# EAGLE design 30ApowerDist (EAGLE 9.1.0)
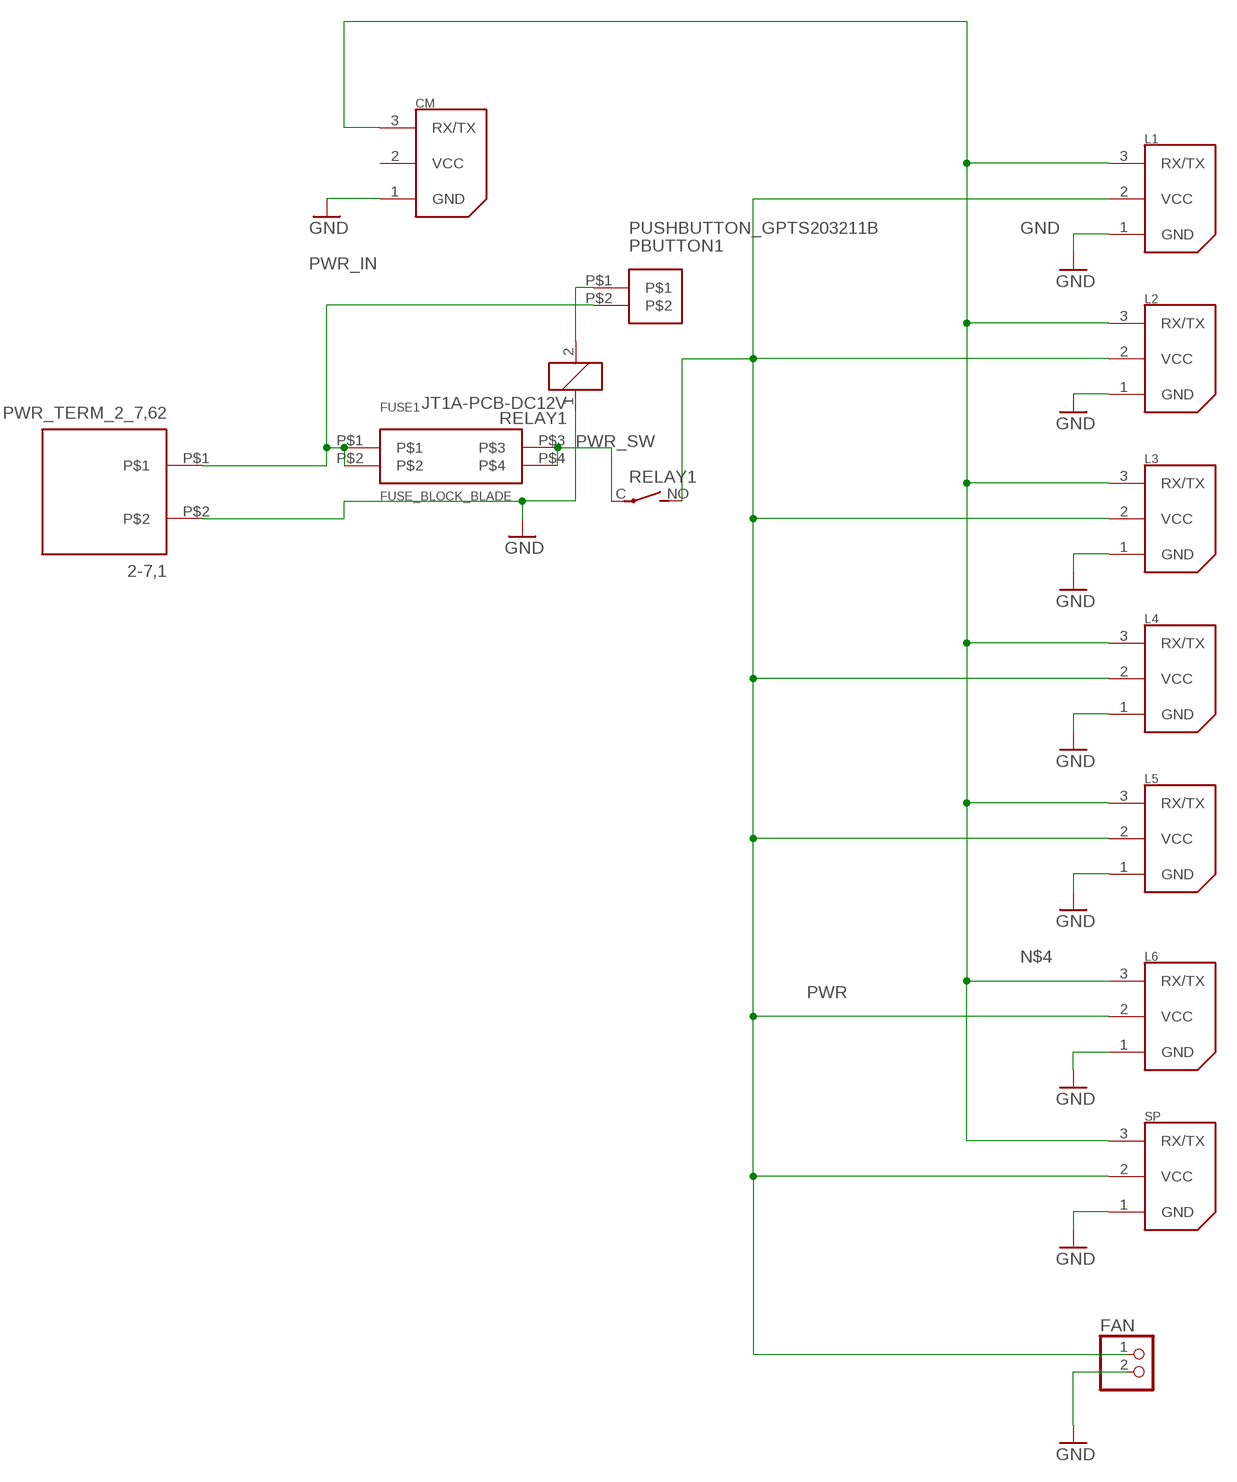
[diagram p0: schematic, sheet 1]

## Parts
2-7,1  PWR_TERM_2_7,62  [PWR_TERM_2_7,62]
CM  22-03-5035  [5267-3]
FAN  PINHD-1X2  [1X02]
FUSE1  FUSE_BLOCK_BLADE  [FUSE_BLOCK_BLADE]
L1  22-03-5035  [5267-3]
L2  22-03-5035  [5267-3]
L3  22-03-5035  [5267-3]
L4  22-03-5035  [5267-3]
L5  22-03-5035  [5267-3]
L6  22-03-5035  [5267-3]
PBUTTON1  PUSHBUTTON_GPTS203211B  [PUSHBUTTON_GPTS203211B]
RELAY1  JT1A-PCB-DC12V  [JT1A-PCB]
SP  22-03-5035  [5267-3]

## Nets
GND: 2-7,1.P$2 CM.1(GND) FAN.2 L1.1(GND) L2.1(GND) L3.1(GND) L4.1(GND) L5.1(GND) L6.1(GND) RELAY1.1 SP.1(GND)
N$1: PBUTTON1.P$1 RELAY1.2
N$4: CM.3(RX/TX) L1.3(RX/TX) L2.3(RX/TX) L3.3(RX/TX) L4.3(RX/TX) L5.3(RX/TX) L6.3(RX/TX) SP.3(RX/TX)
PWR: FAN.1 L1.2(VCC) L2.2(VCC) L3.2(VCC) L4.2(VCC) L5.2(VCC) L6.2(VCC) RELAY1.NO(S) SP.2(VCC)
PWR_IN: 2-7,1.P$1 FUSE1.P$1 FUSE1.P$2 PBUTTON1.P$2
PWR_SW: FUSE1.P$3 FUSE1.P$4 RELAY1.C(P)
Unconnected: CM.2(VCC)

## Library data of the parts
2-7,1 = 30ApwrSupply:PWR_TERM_2_7,62
CM L1-L6 SP = molex:22-03-5035: Molex SPOX Vert, Tin (Dynamixel AX/MX Bus) tested: YES (arbotix)
FAN = pinhead:PINHD-1X2: PIN HEADER
FUSE1 = 30ApwrSupply:FUSE_BLOCK_BLADE
PBUTTON1 = 30ApwrSupply:PUSHBUTTON_GPTS203211B
RELAY1 = relay:JT1A?-*: COMPACT ECONOMICAL 30 AMP. RELAY NAiS Source: http://www.mew-europe.com/.. en_ds_61212_0000.pdf; OC_FARNELL: unknown; OC_NEWARK: unknown

## Board
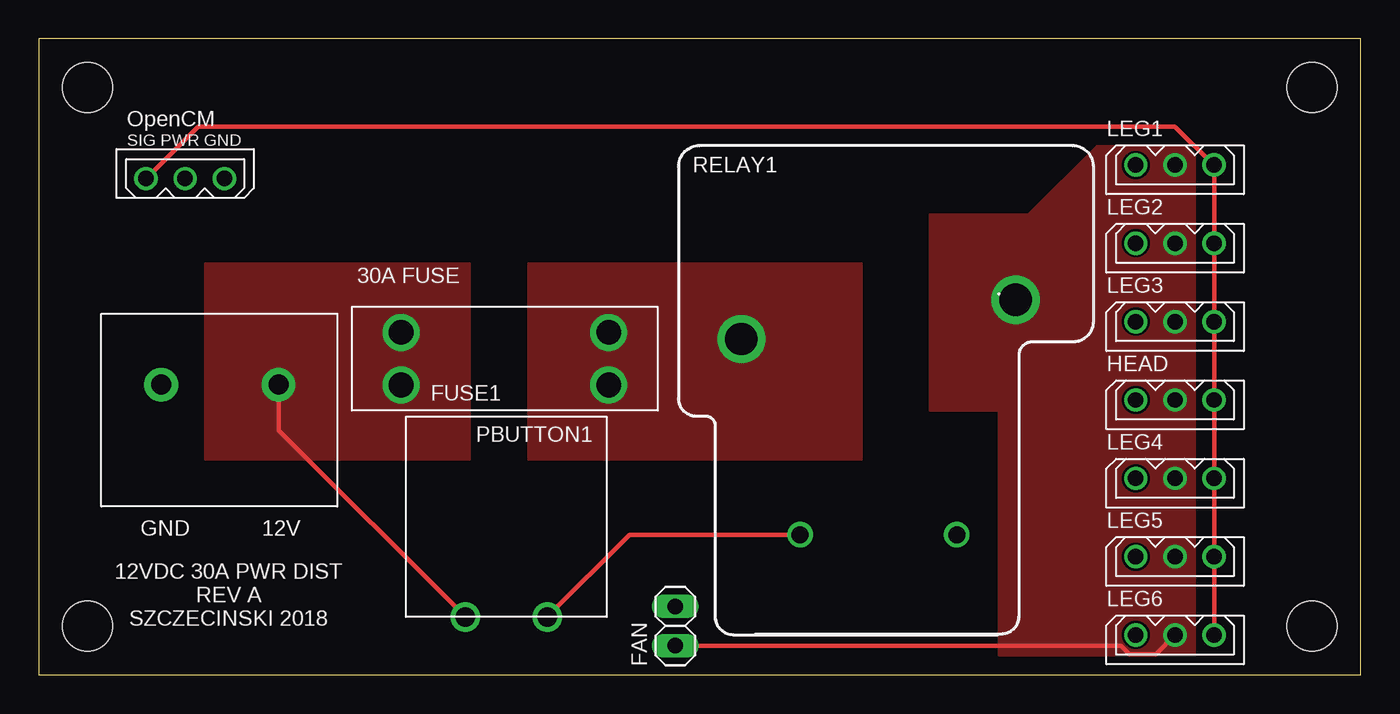
[diagram p1: board, top side]
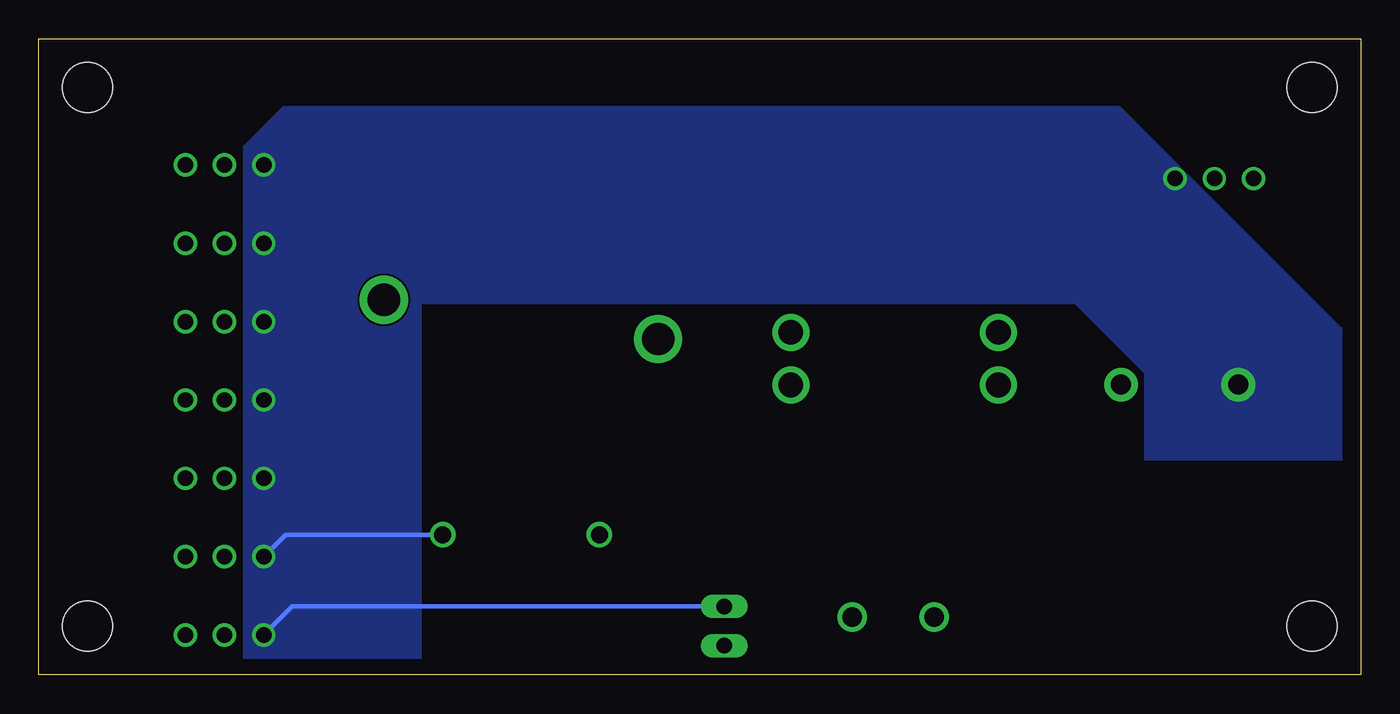
[diagram p2: board, bottom side, seen from below]

Size 85.71 x 41.27 mm. Coordinates in mm from the lower left corner, seen from the top.
Outline: 0,0 85.71,0 85.71,41.27 0,41.27 0,0
Copper layers (1*16): Top 0.035mm / dielectric 1.5mm / Bottom 0.035mm
Design rules "default *": minimum track width 6mil, minimum drill 0.35mm, track to track 6mil, track to pad 6mil, pad to pad 6mil, via to via 6mil, smd to smd 6mil, copper to edge 40mil, drill to drill 6mil, minimum pad ring 10mil, minimum via ring 8mil, stop-mask expansion 4mil, vias tented up to drill 0mil, thermal gap 0mil
Holes 3.25 mm at 3.17,3.17 3.17,38.1 82.55,3.17 82.55,38.1

### Footprints (pad centres in the part's own frame; a part is rotated, then mirrored left to right if it is on the bottom)
PWR_TERM_2_7,62 = drill 1.3 pad 2.184: P$1 11.49,7.9; P$2 3.88,7.9
5267-3 = drill 1: 1 0,0; 2 -2.54,0; 3 -5.08,0
1X02 = drill 1.016 long: 1 -1.27,0; 2 1.27,0
FUSE_BLOCK_BLADE = drill 1.6: P$1 3.175,1.664; P$2 3.175,5.067; P$3 16.637,5.067; P$4 16.637,1.664
PUSHBUTTON_GPTS203211B = drill 1.27: P$1 13,9.15; P$2 13,3.85
JT1A-PCB = drill 1.1: 1 5.08,0; 2 -5.08,0 | drill 2.1: C -8.89,12.7; NO 8.89,15.24

### Placement (x,y rotation side)
2-7,1  4.06,10.92 0 top
CM  12.04,32.19 0 top
FAN  41.27,3.17 90 top
FUSE1  20.32,17.14 0 top
L1  71.12,33.07 180 top
L2  71.12,27.99 180 top
L3  71.12,22.91 180 top
L4  71.12,17.83 180 top
L5  71.12,12.75 180 top
L6  71.12,7.67 180 top
PBUTTON1  23.81,16.75 270 top
RELAY1  54.44,9.09 0 top
SP  71.12,2.59 180 top

### Tracks (layer width: path | path; a pad name or v marks a point on that pad's centre or on a via)
GND
  Bottom 0.305: FAN.2 69.27,4.45 SP.1 | RELAY1.1 69.7,9.09 L6.1
  pour Bottom: 13.97,13.97 1.27,13.97 1.27,22.48 15.62,36.83 69.85,36.83 72.39,34.29 72.39,0.64 60.96,0.64 60.96,24.13 45.72,24.13 18.54,24.13 13.97,19.56
N$1
  Top 0.305: PBUTTON1.P$1 38.3,9.09 RELAY1.2
N$4
  Top 0.152: 76.2,33.02 L1.3
  Top 0.305: SP.3 76.2,5.08 L6.3 L5.3 L4.3 L3.3 L2.3 76.2,33.02 73.66,35.56 10.33,35.56 CM.3
PWR
  Top 0.305: FAN.1 70.16,1.91 70.71,1.35 72.42,1.35 SP.2
  pour Top: 57.78,23.5 57.78,29.84 64.14,29.84 68.58,34.29 74.93,34.29 74.93,1.27 62.23,1.27 62.23,17.14 57.78,17.14
PWR_IN
  Top 0.305: 2-7,1.P$1 15.55,15.87 PBUTTON1.P$2
  pour Top: 27.94,26.67 27.94,13.97 10.79,13.97 10.79,26.67
PWR_SW
  pour Top: 31.75,26.67 31.75,13.97 53.34,13.97 53.34,26.67

### Text on the board
tNames: OpenCM | LEG1 | SIG PWR GND | LEG2 | 30A FUSE | LEG3 | HEAD | LEG4 | LEG5 | GND 12V | LEG6 | 12VDC 30A PWR DIST / REV A / SZCZECINSKI 2018